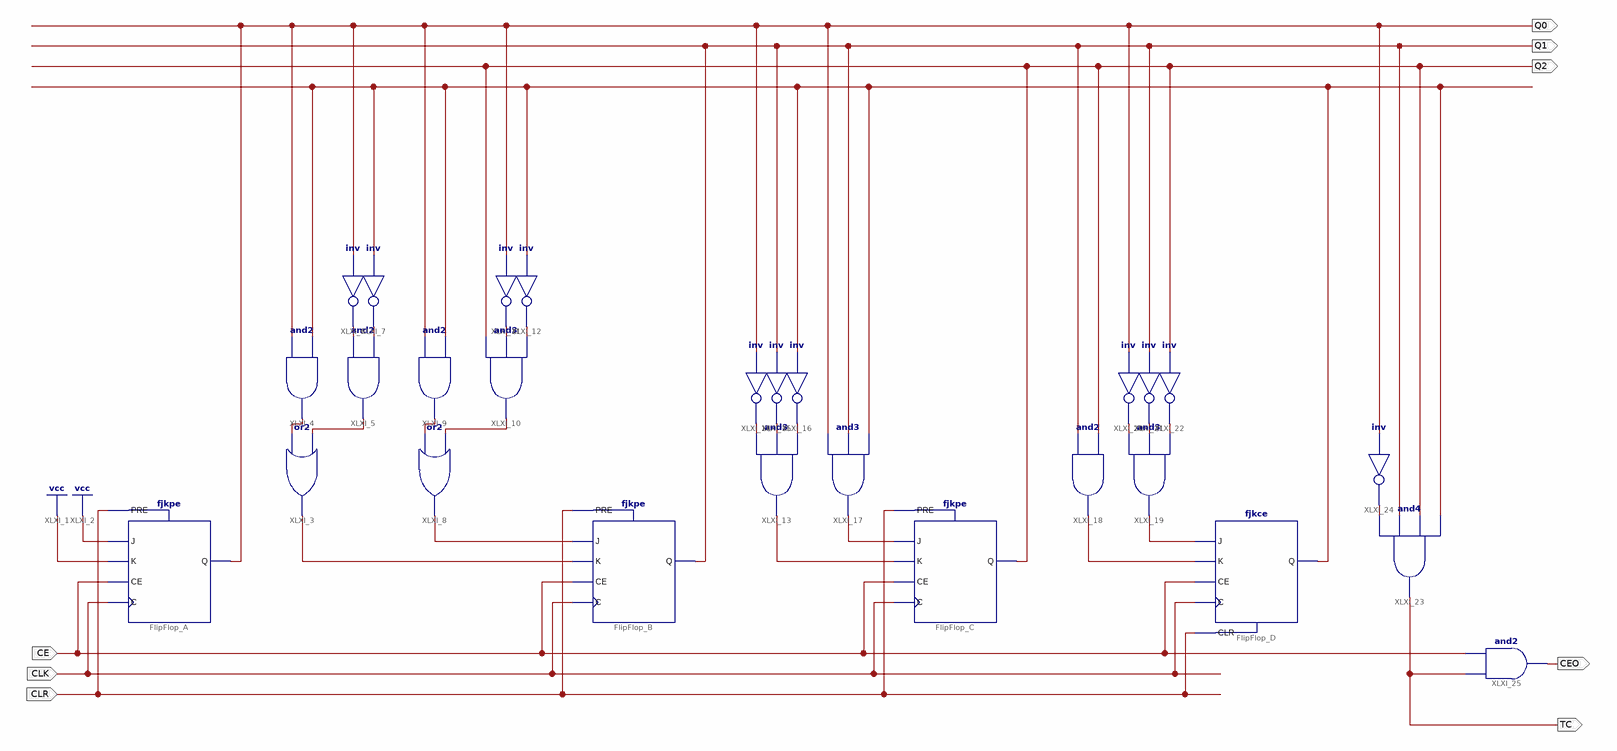
[diagram p0: schematic sheet 1]
// Xilinx ISE schematic counter706.sch (spartan6) as structural Verilog: 27 symbols, 8 ports
module counter706 (
  input  CE,
  input  CLK,
  input  CLR,
  output CEO,
  output TC,
  output Q0,
  output Q1,
  output Q2
);

  wire Q3, XLXN_3, XLXN_4, XLXN_5, XLXN_6, XLXN_7, XLXN_8, XLXN_9, XLXN_10, XLXN_11, XLXN_12, XLXN_13,
       XLXN_14, XLXN_15, XLXN_16, XLXN_17, XLXN_18, XLXN_19, XLXN_20, XLXN_21, XLXN_22, XLXN_23;

  fjkpe FlipFlop_A (.C(CLK), .CE(CE), .J(1'b1), .K(1'b1), .PRE(CLR), .Q(Q0));
  or XLXI_3 (XLXN_3, XLXN_4, XLXN_5);
  and XLXI_4 (XLXN_4, Q0, Q3);
  and XLXI_5 (XLXN_5, XLXN_6, XLXN_7);
  not XLXI_6 (XLXN_6, Q0);
  not XLXI_7 (XLXN_7, Q3);
  or XLXI_8 (XLXN_8, XLXN_9, XLXN_10);
  and XLXI_9 (XLXN_9, Q0, Q3);
  and XLXI_10 (XLXN_10, Q2, XLXN_11, XLXN_12);
  not XLXI_11 (XLXN_11, Q0);
  not XLXI_12 (XLXN_12, Q3);
  fjkpe FlipFlop_B (.C(CLK), .CE(CE), .J(XLXN_8), .K(XLXN_3), .PRE(CLR), .Q(Q1));
  and XLXI_13 (XLXN_13, XLXN_14, XLXN_15, XLXN_16);
  not XLXI_14 (XLXN_14, Q0);
  not XLXI_15 (XLXN_15, Q1);
  not XLXI_16 (XLXN_16, Q3);
  and XLXI_17 (XLXN_17, Q0, Q1, Q3);
  fjkpe FlipFlop_C (.C(CLK), .CE(CE), .J(XLXN_17), .K(XLXN_13), .PRE(CLR), .Q(Q2));
  and XLXI_18 (XLXN_18, Q1, Q2);
  and XLXI_19 (XLXN_19, XLXN_20, XLXN_21, XLXN_22);
  not XLXI_20 (XLXN_20, Q0);
  not XLXI_21 (XLXN_21, Q1);
  not XLXI_22 (XLXN_22, Q2);
  fjkce FlipFlop_D (.C(CLK), .CE(CE), .CLR(CLR), .J(XLXN_19), .K(XLXN_18), .Q(Q3));
  and XLXI_23 (TC, XLXN_23, Q1, Q2, Q3);
  not XLXI_24 (XLXN_23, Q0);
  and XLXI_25 (CEO, CE, TC);
endmodule
